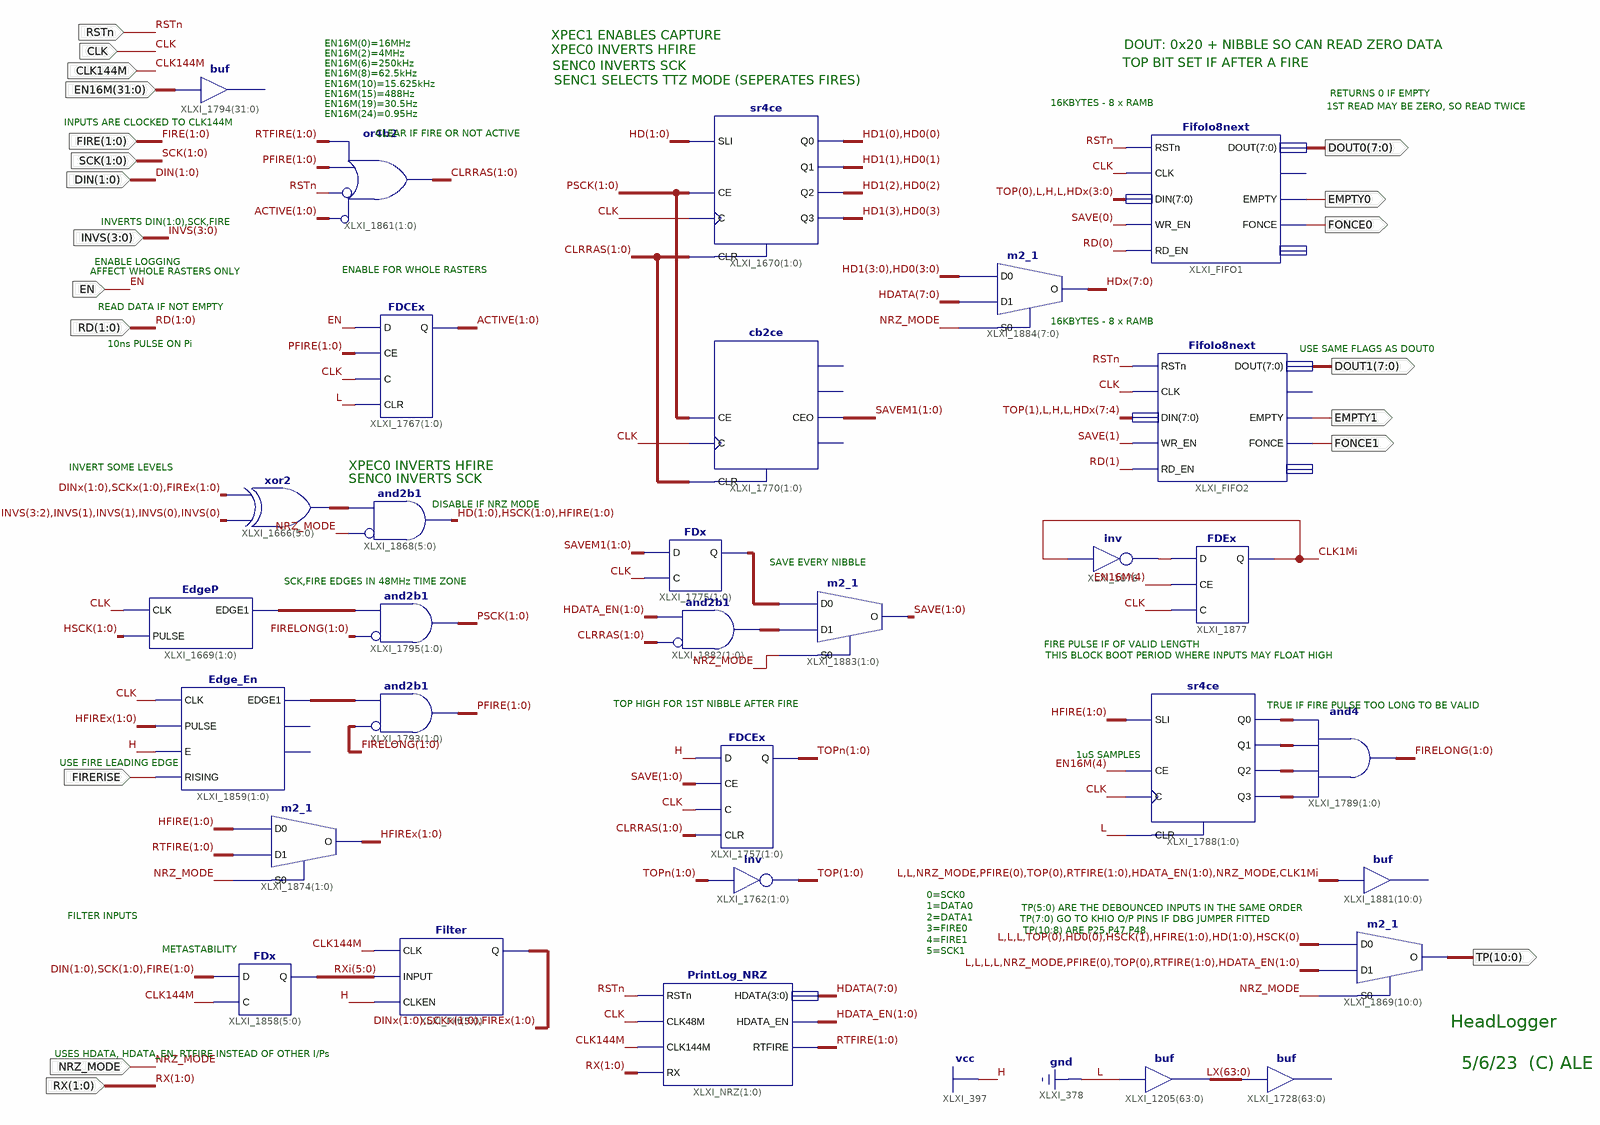
[diagram p0: schematic sheet 1]
// Xilinx ISE schematic HeadLogger - Copy01.sch (spartan3e) as structural Verilog: 31 symbols, 21 ports
module \HeadLogger_-_Copy01  (
  input  CLK,
  input  RSTn,
  input  [3:0] INVS,
  input  [1:0] RD,
  input  EN,
  input  [31:0] EN16M,
  input  [1:0] DIN,
  input  CLK144M,
  input  [1:0] FIRE,
  input  [1:0] SCK,
  input  NRZ_MODE,
  input  FIRERISE,
  input  [1:0] RX,
  output [7:0] DOUT0,
  output [7:0] DOUT1,
  output EMPTY0,
  output EMPTY1,
  output FONCE0,
  output FONCE1,
  output [10:0] TP
);

  wire CLK1Mi, XLXN_167;
  wire [1:0] ACTIVE, CLRRAS, DINx, FIRELONG, FIREx, HD, HDATA_EN, HFIRE, HFIREx, HSCK, PFIRE, PSCK, RTFIRE,
       SAVE, SAVEM1, SCKx, TOP, TOPn, XLXN_78, XLXN_79, XLXN_107, XLXN_108, XLXN_109, XLXN_110, XLXN_147,
       XLXN_177;
  wire [3:0] HD0, HD1;
  wire [5:0] RXi, XLXN_156;
  wire [7:0] HDATA, HDx;
  wire [63:0] LX;

  FifoIo8next XLXI_FIFO1 (
    .CLK(CLK), .DIN({TOP[0], 3'b010, HDx[3:0]}), .DOUT(DOUT0), .EMPTY(EMPTY0), .FONCE(FONCE0), .RD_EN(RD[0]),
    .RSTn(RSTn), .WR_EN(SAVE[0]));  // open: FULL, TP
  FifoIo8next XLXI_FIFO2 (
    .CLK(CLK), .DIN({TOP[1], 3'b010, HDx[7:4]}), .DOUT(DOUT1), .EMPTY(EMPTY1), .FONCE(FONCE1), .RD_EN(RD[1]),
    .RSTn(RSTn), .WR_EN(SAVE[1]));  // open: FULL, TP
  // buf XLXI_1794[31..0] has open pins: I=EN16M, O=open
  assign PSCK = ~FIRELONG & XLXN_78;  // and2b1 XLXI_1795[1..0], 2 bits wide
  assign PFIRE = ~FIRELONG & XLXN_79;  // and2b1 XLXI_1793[1..0], 2 bits wide
  EdgeP XLXI_1669[1:0] (.CLK(CLK), .EDGE1(XLXN_78), .PULSE(HSCK));
  sr4ce XLXI_1670[1:0] (
    .C(CLK), .CE(PSCK), .CLR(CLRRAS), .SLI(HD), .Q0({HD1[0], HD0[0]}), .Q1({HD1[1], HD0[1]}),
    .Q2({HD1[2], HD0[2]}), .Q3({HD1[3], HD0[3]}));
  cb2ce XLXI_1770[1:0] (.C(CLK), .CE(PSCK), .CLR(CLRRAS), .CEO(SAVEM1));  // open: Q0, Q1, TC
  FDx XLXI_1858[5:0] (.C(CLK144M), .D({DIN, SCK, FIRE}), .Q(RXi));
  Filter XLXI_Filt[5:0] (.CLK(CLK144M), .CLKEN(1'b1), .INPUT(RXi), .Q({DINx, SCKx, FIREx}));
  FDCEx XLXI_1767[1:0] (.C(CLK), .CE(PFIRE), .CLR(1'b0), .D(EN), .Q(ACTIVE));
  assign CLRRAS = ~ACTIVE | ~{2{RSTn}} | PFIRE | RTFIRE;  // or4b2 XLXI_1861[1..0], 2 bits wide
  sr4ce XLXI_1788[1:0] (
    .C(CLK), .CE(EN16M[4]), .CLR(1'b0), .SLI(HFIRE), .Q0(XLXN_110), .Q1(XLXN_109), .Q2(XLXN_108),
    .Q3(XLXN_107));
  assign FIRELONG = XLXN_107 & XLXN_108 & XLXN_109 & XLXN_110;  // and4 XLXI_1789[1..0], 2 bits wide
  FDx XLXI_1775[1:0] (.C(CLK), .D(SAVEM1), .Q(XLXN_147));
  Edge_En XLXI_1859[1:0] (
    .CLK(CLK), .E(1'b1), .EDGE1(XLXN_79), .PULSE(HFIREx), .RISING(FIRERISE));  // open: EDGE0, EDGEQUICK
  assign XLXN_156 = {INVS[3:1], INVS[1:0], INVS[0]} ^ {DINx, SCKx, FIREx};  // xor2 XLXI_1666[5..0], 6 bits wide
  assign {HD, HSCK, HFIRE} = ~{6{NRZ_MODE}} & XLXN_156;  // and2b1 XLXI_1868[5..0], 6 bits wide
  m2_1 XLXI_1874[1:0] (.D0(HFIRE), .D1(RTFIRE), .S0(NRZ_MODE), .O(HFIREx));
  FDEx XLXI_1877 (.C(CLK), .CE(EN16M[4]), .D(XLXN_167), .Q(CLK1Mi));
  not XLXI_1876 (XLXN_167, CLK1Mi);
  m2_1 XLXI_1869[10:0] (
    .D0({3'b000, TOP[0], HD0[0], HSCK[1], HFIRE, HD, HSCK[0]}),
    .D1({4'b0000, NRZ_MODE, PFIRE[0], TOP[0], RTFIRE, HDATA_EN}), .S0(NRZ_MODE), .O(TP));
  // buf XLXI_1881[10..0] has open pins: I={2'b00, NRZ_MODE, PFIRE[0], TOP[0], RTFIRE, HDATA_EN, NRZ_MODE, CLK1Mi}, O=open
  PrintLog_NRZ XLXI_NRZ[1:0] (
    .CLK144M(CLK144M), .CLK48M(CLK), .HDATA(HDATA), .HDATA_EN(HDATA_EN), .RSTn(RSTn), .RTFIRE(RTFIRE), .RX(RX));
  assign LX = {64{1'b0}};  // buf XLXI_1205[63..0], 64 bits wide
  // buf XLXI_1728[63..0] has open pins: I=LX, O=open
  assign XLXN_177 = ~CLRRAS & HDATA_EN;  // and2b1 XLXI_1882[1..0], 2 bits wide
  FDCEx XLXI_1757[1:0] (.C(CLK), .CE(SAVE), .CLR(CLRRAS), .D(1'b1), .Q(TOPn));
  assign TOP = ~TOPn;  // inv XLXI_1762[1..0], 2 bits wide
  m2_1 XLXI_1883[1:0] (.D0(XLXN_147), .D1(XLXN_177), .S0(NRZ_MODE), .O(SAVE));
  m2_1 XLXI_1884[7:0] (.D0({HD1, HD0}), .D1(HDATA), .S0(NRZ_MODE), .O(HDx));

  // Notes on the sheet:
  //   XPEC1 ENABLES CAPTURE
  //   EN16M(0)=16MHz
  //   DOUT: 0x20 + NIBBLE SO CAN READ ZERO DATA
  //   XPEC0 INVERTS HFIRE
  //   EN16M(2)=4MHz
  //   TOP BIT SET IF AFTER A FIRE
  //   EN16M(6)=250kHz
  //   SENC0 INVERTS SCK
  //   EN16M(8)=62.5kHz
  //   SENC1 SELECTS TTZ MODE (SEPERATES FIRES)
  //   EN16M(10)=15.625kHz
  //   RETURNS 0 IF EMPTY
  //   EN16M(15)=488Hz
  //   16KBYTES - 8 x RAMB
  //   EN16M(19)=30.5Hz
  //   1ST READ MAY BE ZERO, SO READ TWICE
  //   EN16M(24)=0.95Hz
  //   INPUTS ARE CLOCKED TO CLK144M
  //   CLEAR IF FIRE OR NOT ACTIVE
  //   INVERTS DIN(1:0),SCK,FIRE
  //   ENABLE LOGGING
  //   ENABLE FOR WHOLE RASTERS
  //   AFFECT WHOLE RASTERS ONLY
  //   READ DATA IF NOT EMPTY
  //   16KBYTES - 8 x RAMB
  //   10ns PULSE ON Pi
  //   USE SAME FLAGS AS DOUT0
  //   XPEC0 INVERTS HFIRE
  //   INVERT SOME LEVELS
  //   SENC0 INVERTS SCK
  //   DISABLE IF NRZ MODE
  //   SAVE EVERY NIBBLE
  //   SCK,FIRE EDGES IN 48MHz TIME ZONE
  //   FIRE PULSE IF OF VALID LENGTH
  //   THIS BLOCK BOOT PERIOD WHERE INPUTS MAY FLOAT HIGH
  //   TOP HIGH FOR 1ST NIBBLE AFTER FIRE
  //   TRUE IF FIRE PULSE TOO LONG TO BE VALID
  //   1uS SAMPLES
  //   USE FIRE LEADING EDGE
  //   0=SCK0
  //   1=DATA0
  //   TP(5:0) ARE THE DEBOUNCED INPUTS IN THE SAME ORDER
  //   FILTER INPUTS
  //   2=DATA1
  //   TP(7:0) GO TO KHIO O/P PINS IF DBG JUMPER FITTED
  //   3=FIRE0
  //   TP(10:8) ARE P25,P47,P48
  //   4=FIRE1
  //   METASTABILITY
  //   5=SCK1
  //   HeadLogger
  //   USES HDATA, HDATA_EN, RTFIRE INSTEAD OF OTHER I/Ps
  //   5/6/23  (C) ALE
endmodule
